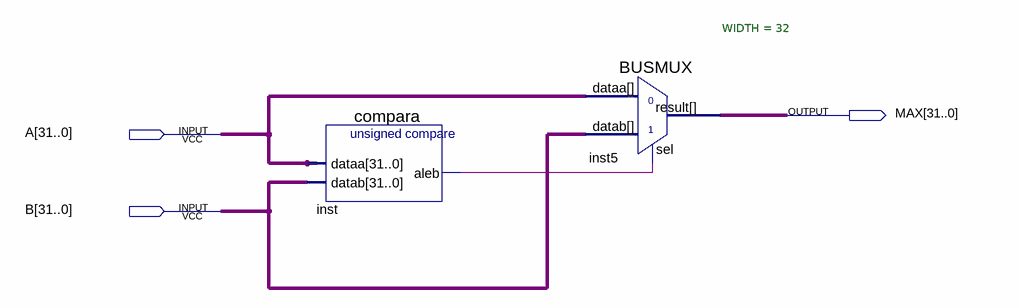
[diagram p0: schematic sheet]
// Quartus schematic max.bdf as structural Verilog: 2 symbols, 3 pins
module max (
  input  [31:0] A,
  input  [31:0] B,
  output [31:0] MAX
);

  wire inst_aleb;

  compara inst (.dataa(A), .datab(B), .aleb(inst_aleb));
  BUSMUX #(.WIDTH(32)) inst5 (.datab(B), .sel(inst_aleb), .dataa(A), .result(MAX));
endmodule
